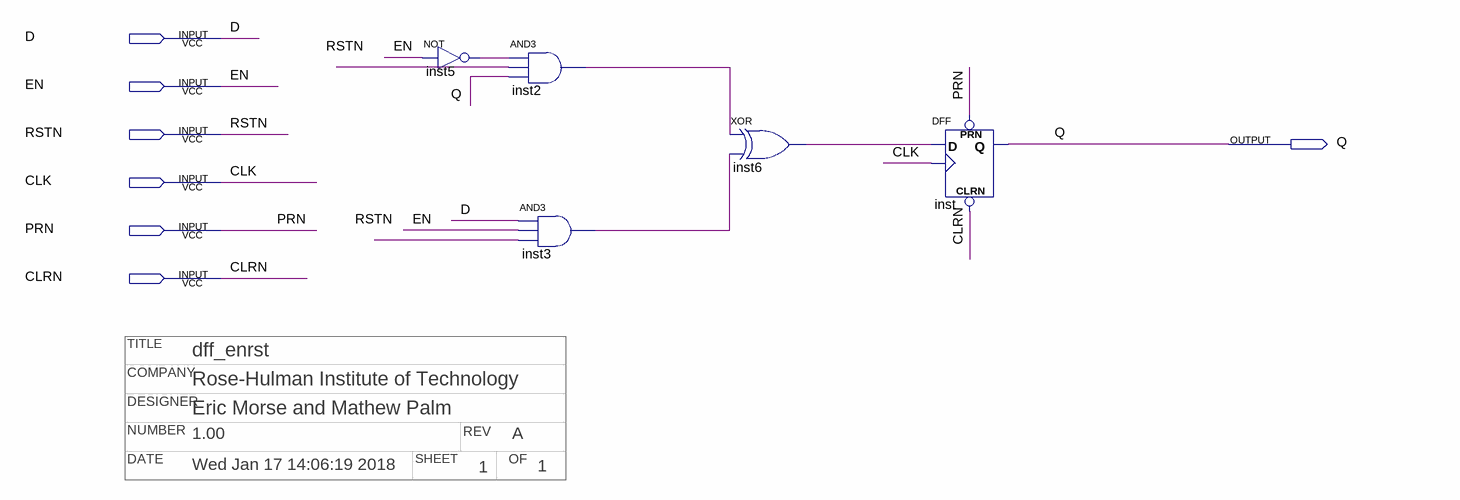
[diagram p0: schematic sheet]
// Quartus schematic dff_enrst.bdf as structural Verilog: 5 symbols, 7 pins
// Title block: COMPANY: Rose-Hulman Institute of Technology; DATE: Wed Jan 17 14:06:19 2018; DESIGNER: Eric Morse and Mathew Palm; NUMBER: 1.00; OF: 1; REV: A; SHEET: 1; TITLE: dff_enrst
module dff_enrst (
  input  D,
  input  EN,
  input  RSTN,
  input  CLK,
  input  PRN,
  input  CLRN,
  output Q
);

  wire inst2_out, inst3_out, inst5_out, inst6_out;

  not inst5 (inst5_out, EN);
  and inst2 (inst2_out, inst5_out, RSTN, Q);
  and inst3 (inst3_out, D, EN, RSTN);
  xor inst6 (inst6_out, inst2_out, inst3_out);
  DFF inst (.CLRN(CLRN), .CLK(CLK), .D(inst6_out), .PRN(PRN), .Q(Q));
endmodule
